# EAGLE design spoke-indus (EAGLE 5.10)
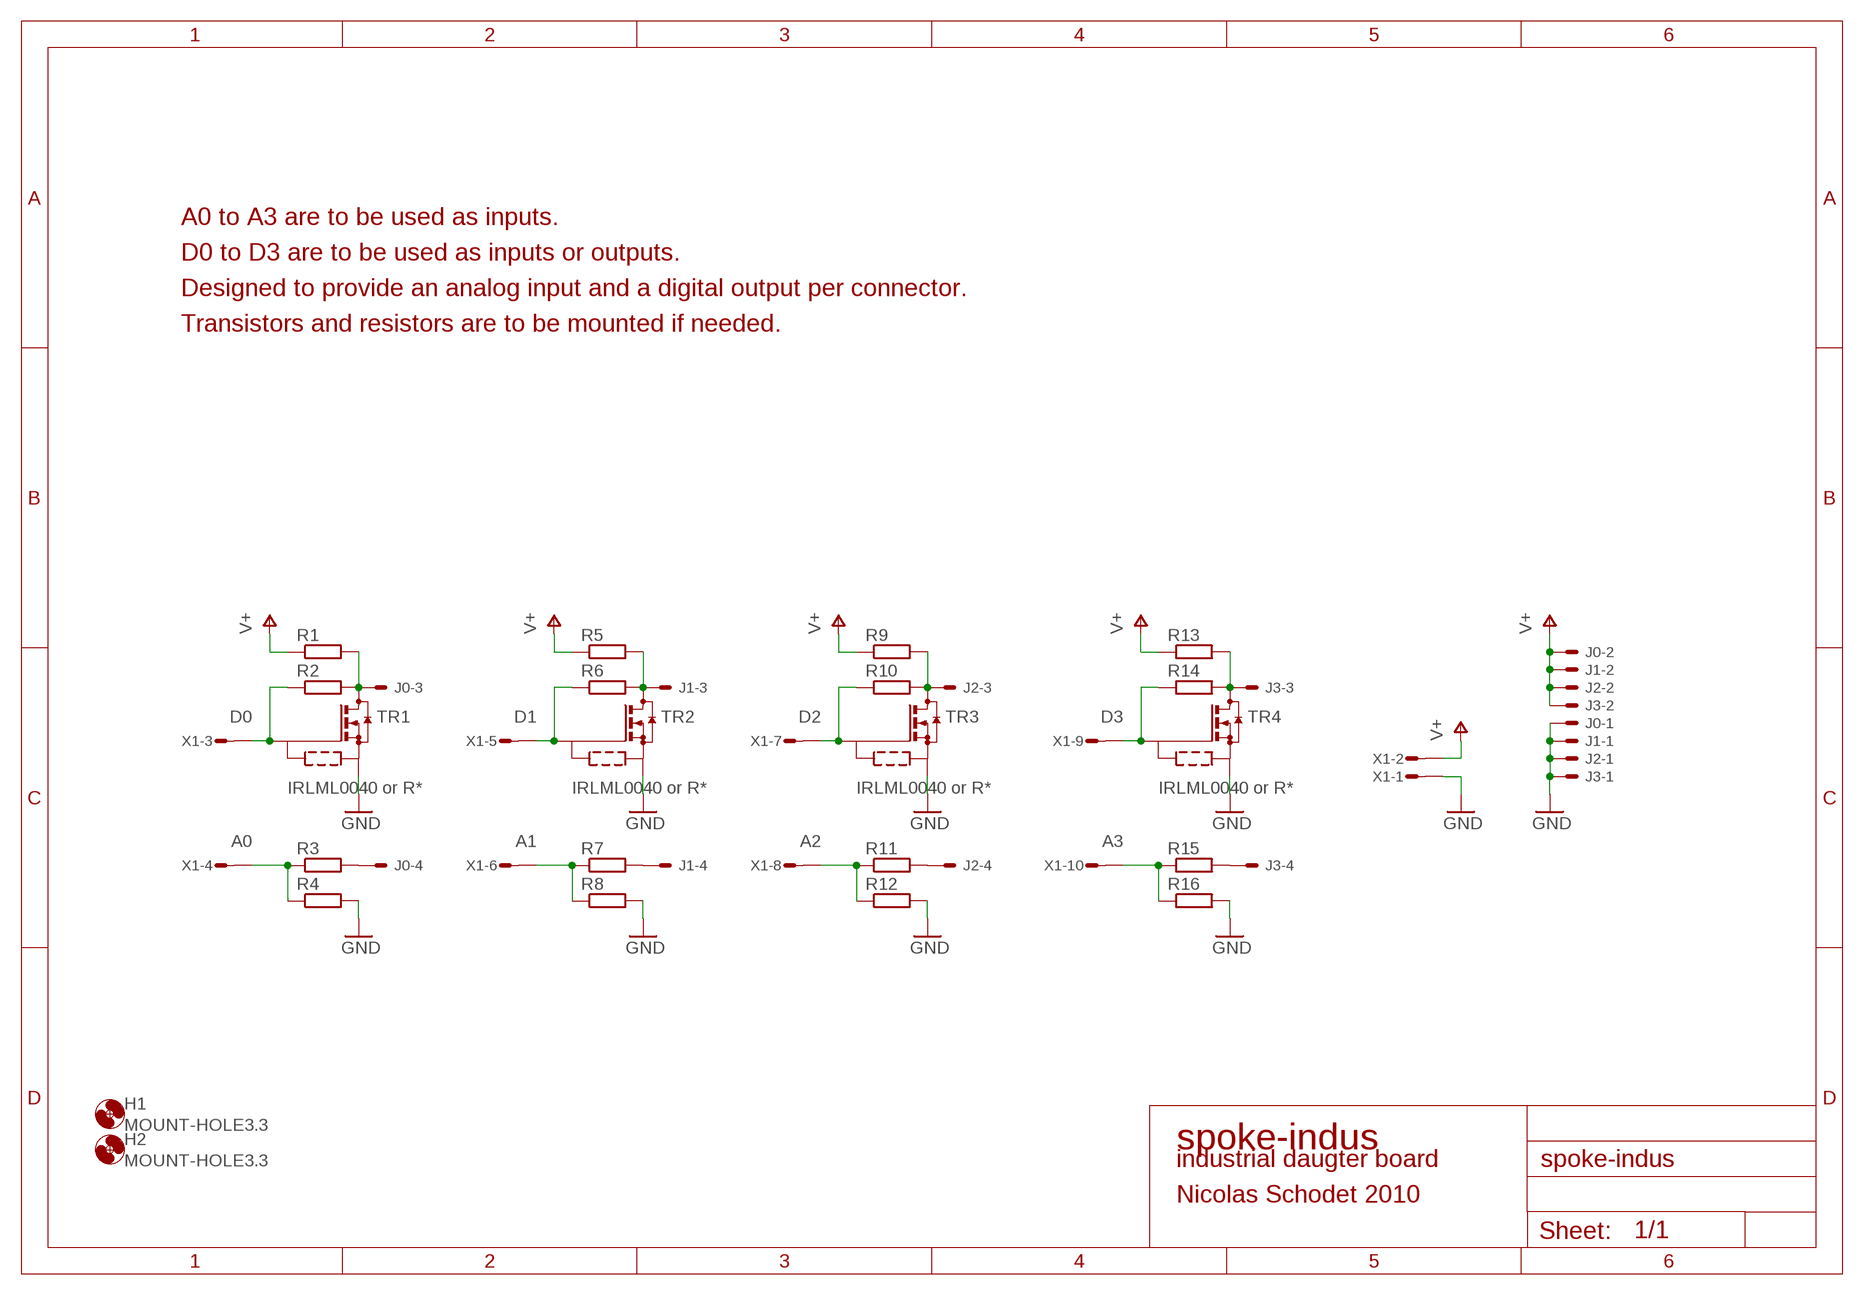
[diagram p0: schematic, sheet 1]

## Parts
H1  MOUNT-HOLE3.3  [3,3]
H2  MOUNT-HOLE3.3  [3,3]
J0  ED1X04  [ED1X04]
J1  ED1X04  [ED1X04]
J2  ED1X04  [ED1X04]
J3  ED1X04  [ED1X04]
R1  R-EU_R0603  [R0603]
R2  R-EU_R0603  [R0603]
R3  R-EU_R0603  [R0603]
R4  R-EU_R0603  [R0603]
R5  R-EU_R0603  [R0603]
R6  R-EU_R0603  [R0603]
R7  R-EU_R0603  [R0603]
R8  R-EU_R0603  [R0603]
R9  R-EU_R0603  [R0603]
R10  R-EU_R0603  [R0603]
R11  R-EU_R0603  [R0603]
R12  R-EU_R0603  [R0603]
R13  R-EU_R0603  [R0603]
R14  R-EU_R0603  [R0603]
R15  R-EU_R0603  [R0603]
R16  R-EU_R0603  [R0603]
TR1  IRLML0040 or R*  N-MOS_R  [SOT23_R0603]
TR2  IRLML0040 or R*  N-MOS_R  [SOT23_R0603]
TR3  IRLML0040 or R*  N-MOS_R  [SOT23_R0603]
TR4  IRLML0040 or R*  N-MOS_R  [SOT23_R0603]
X1  MICROMATCH-10  [MICROMATCH-10]

## Nets
A0: R3.1 R4.1 X1.4
A0J: J0.3 R1.2 R2.2 TR1.3(D)
A1: R7.1 R8.1 X1.6
A1J: J1.3 R5.2 R6.2 TR2.3(D)
A2: R11.1 R12.1 X1.8
A2J: J2.3 R9.2 R10.2 TR3.3(D)
A3: R15.1 R16.1 X1.10
A3J: J3.3 R13.2 R14.2 TR4.3(D)
D0: R2.1 TR1.1(G) X1.3
D1: R6.1 TR2.1(G) X1.5
D2: R10.1 TR3.1(G) X1.7
D3: R14.1 TR4.1(G) X1.9
F0J: J0.4 R3.2
F1J: J1.4 R7.2
F2J: J2.4 R11.2
F3J: J3.4 R15.2
GND [supply]: J0.1 J1.1 J2.1 J3.1 R4.2 R8.2 R12.2 R16.2 TR1.2(S) TR2.2(S) TR3.2(S) TR4.2(S) X1.1
V+: J0.2 J1.2 J2.2 J3.2 R1.1 R5.1 R9.1 R13.1 X1.2

## Notes on the sheet
- A0 to A3 are to be used as inputs.
- D0 to D3 are to be used as inputs or outputs.
- Designed to provide an analog input and a digital output per connector.
- Transistors and resistors are to be mounted if needed.
- spoke-indus
- industrial daugter board
- Nicolas Schodet 2010

## Library data of the parts
H1 H2 = holes:MOUNT-HOLE: MOUNTING HOLE with drill center marker
J0 J1-J3 = apbteam_con-amp-he14:E?1X04: Male header simple row, 4 positions
R1-R16 = apbteam_rcl:R-EU_: RESISTOR, European symbol
TR1-TR4 = apbteam_transistor-small-signal:N-MOS_R: N-CHANNEL MOS FET or Resistor Only one can be mounted.
X1 = apbteam_con-amp-micromatch:MICROMATCH-10: MicroMaTch 10

## Net classes
1 supply: width 0.254 mm

## Board
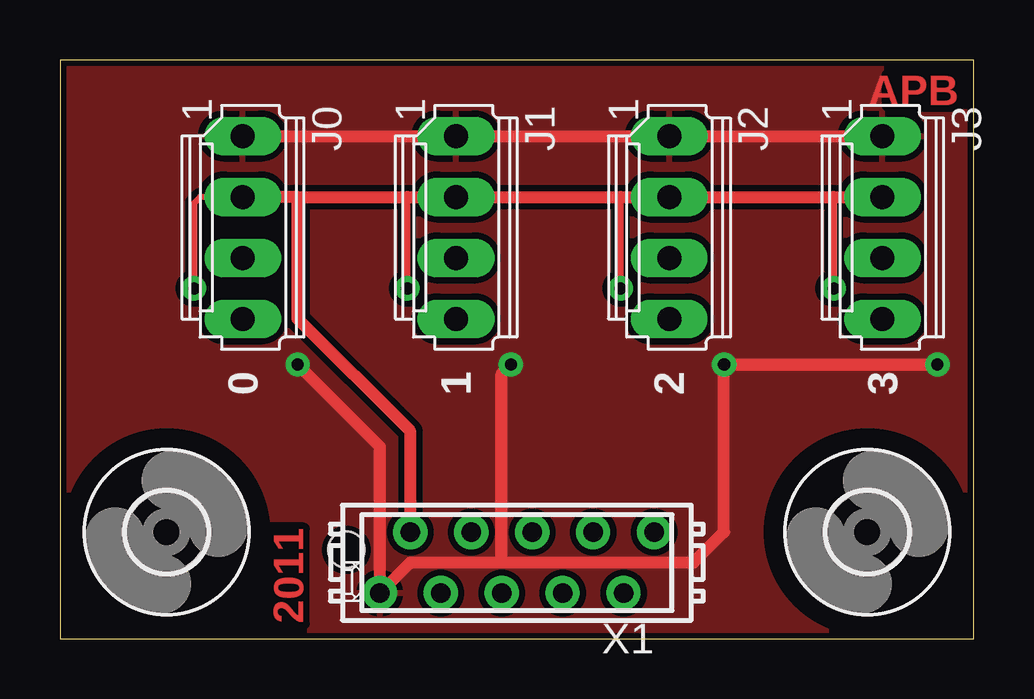
[diagram p1: board, top side]
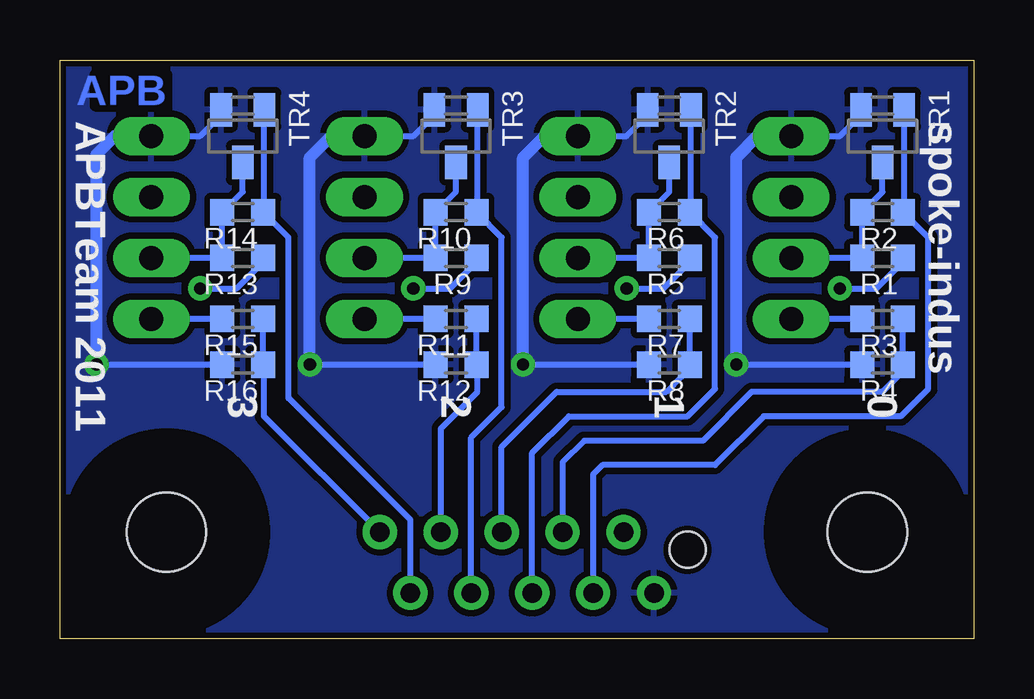
[diagram p2: board, bottom side, seen from below]

Size 38.1 x 24.13 mm. Coordinates in mm from the lower left corner, seen from the top.
Outline: 0,0 38.1,0 38.1,24.13 0,24.13 0,0
Copper layers (1*16): Top 0.035mm / dielectric 1.5mm / Bottom 0.035mm
Design rules "SparkFun": minimum track width 8mil, minimum drill 20mil, track to track 8mil, track to pad 8mil, pad to pad 8mil, via to via 8mil, smd to smd 8mil, copper to edge 10mil, drill to drill 8mil, minimum pad ring 12mil, minimum via ring 10mil, stop-mask expansion 4mil, vias tented up to drill 25mil, thermal gap 10mil

### Footprints (pad centres in the part's own frame; a part is rotated, then mirrored left to right if it is on the bottom)
3,3 = hole 3.3: 0,0
ED1X04 = drill 1 long: 1 -3.81,0; 2 -1.27,0; 3 1.27,0; 4 3.81,0
R0603 = smd 1 x 1.1: 1 -0.85,0; 2 0.85,0
SOT23_R0603 = smd 0.9 x 1.4: 1 -0.9,-1.1; 2 0.9,-1.1; 3 0,1.1
MICROMATCH-10 = drill 0.813 round: 1 5.715,1.27; 2 4.445,-1.27; 3 3.175,1.27; 4 1.905,-1.27; 5 0.635,1.27; 6 -0.635,-1.27; 7 -1.905,1.27; 8 -3.175,-1.27; 9 -4.445,1.27; 10 -5.715,-1.27 | hole 1.5: 7.11,-0.53

### Placement (x,y rotation side)
H1  4.45,4.45 0 top
H2  33.66,4.45 0 top
J0  7.62,17.14 270 top
J1  16.51,17.14 270 top
J2  25.4,17.14 270 top
J3  34.29,17.14 270 top
R1  3.81,15.88 180 bottom
R2  3.81,17.78 180 bottom
R3  3.81,13.34 180 bottom
R4  3.81,11.43 180 bottom
R5  12.7,15.88 180 bottom
R6  12.7,17.78 180 bottom
R7  12.7,13.34 180 bottom
R8  12.7,11.43 180 bottom
R9  21.59,15.88 180 bottom
R10  21.59,17.78 180 bottom
R11  21.59,13.34 180 bottom
R12  21.59,11.43 180 bottom
R13  30.48,15.88 180 bottom
R14  30.48,17.78 180 bottom
R15  30.48,13.34 180 bottom
R16  30.48,11.43 180 bottom
TR1  3.81,20.95 180 bottom
TR2  12.7,20.95 180 bottom
TR3  21.59,20.95 180 bottom
TR4  30.48,20.95 180 bottom
X1  19.05,3.17 180 top

### Tracks (layer width: path | path; a pad name or v marks a point on that pad's centre or on a via)
A0
  Bottom 0.254: R3.1 R4.1 3.17,11.21 3.17,10.92 3.81,10.29 9.27,10.29 11.3,8.26 16.26,8.26 17.14,7.37 X1.4
A0J
  Bottom 0.254: TR1.3 3.81,18.63 R2.2 R1.2 J0.3
A1
  Bottom 0.254: R7.1 R8.1 12.19,11.09 12.19,10.92 12.83,10.29 17.4,10.29 19.68,8 X1.6
A1J
  Bottom 0.254: TR2.3 12.7,18.63 R6.2 R5.2 J1.3
A2
  Bottom 0.254: R11.1 R12.1 20.7,11.39 20.7,10.29 22.23,8.76 X1.8
A2J
  Bottom 0.254: TR3.3 21.59,18.63 R10.2 R9.2 J2.3
A3
  Bottom 0.254: R15.1 R16.1 29.59,11.39 29.59,9.27 X1.10
A3J
  Bottom 0.254: TR4.3 30.48,18.63 R14.2 R13.2 J3.3
D0
  Bottom 0.254: TR1.1 2.91,17.83 R2.1 1.91,16.73 1.91,10.41 3.05,9.27 8.76,9.27 10.79,7.24 15.49,7.24 15.88,6.86 X1.3
D1
  Bottom 0.254: TR2.1 11.8,17.83 R6.1 10.79,16.73 10.79,10.41 11.94,9.27 16.89,9.27 18.41,7.75 X1.5
D2
  Bottom 0.254: TR3.1 20.69,17.83 R10.1 19.68,16.73 19.68,9.65 20.95,8.38 X1.7
D3
  Bottom 0.254: TR4.1 29.58,17.83 R14.1 28.57,16.73 28.57,10.03 23.5,4.95 X1.9
F0J
  Bottom 0.254: R3.2 J0.4
F1J
  Bottom 0.254: R7.2 J1.4
F2J
  Bottom 0.254: R11.2 J2.4
F3J
  Bottom 0.254: R15.2 J3.4
GND  (via drill 0.51)
  Top 0.508: J0.1 J1.1 J2.1 J3.1 | v9.91,11.43 13.34,8 X1.1 14.61,3.17 18.41,3.17 | 18.41,3.17 18.41,11.05 v18.8,11.43 | 18.41,3.17 26.42,3.17 27.69,4.45 v27.69,11.43 v36.58,11.43
  Bottom 0.254: TR1.2 4.71,21.83 5.59,20.95 J0.1 | TR2.2 13.6,21.83 14.48,20.95 J1.1 | TR3.2 22.49,21.83 23.37,20.95 J2.1 | TR4.2 31.38,21.83 32.26,20.95 J3.1 | v9.91,11.43 R4.2 | v18.8,11.43 R8.2 | v27.69,11.43 R12.2 | v36.58,11.43 R16.2
  Bottom 0.508: J0.1 9.02,20.95 9.91,20.07 v9.91,11.43 | v18.8,11.43 18.8,20.07 17.91,20.95 J1.1 | v27.69,11.43 27.69,20.07 26.8,20.95 J2.1 | v36.58,11.43 36.58,20.19 35.81,20.95 J3.1
  pour Top (isolate 0.254): 0,24.13 38.1,24.13 38.1,0 0,0
  pour Bottom (isolate 0.254): 0,24.13 38.1,24.13 38.1,0 0,0
V+  (via drill 0.51)
  Top 0.254: 23.37,18.41 v23.37,14.61 | 32.26,18.41 v32.26,14.61 | 14.48,18.41 v14.48,14.61 | v5.59,14.61 5.59,18.16 5.84,18.41 J0.2
  Top 0.508: J3.2 32.26,18.41 J2.2 23.37,18.41 J1.2 14.48,18.41 9.91,18.41 | 9.91,18.41 J0.2 | X1.2 14.61,8.64 9.91,13.34 9.91,18.41
  Bottom 0.254: R9.1 20.74,15.71 21.84,14.61 v23.37,14.61 | R13.1 29.63,15.71 30.73,14.61 v32.26,14.61 | R5.1 11.85,15.71 12.95,14.61 v14.48,14.61 | R1.1 2.96,15.71 4.06,14.61 v5.59,14.61

### Text on the board
Top: APB | 2011
Bottom: APB
tSilk: 0 | 1 | 2 | 3
bSilk: spoke-indus | APBTeam 2011 | 0 | 1 | 2 | 3